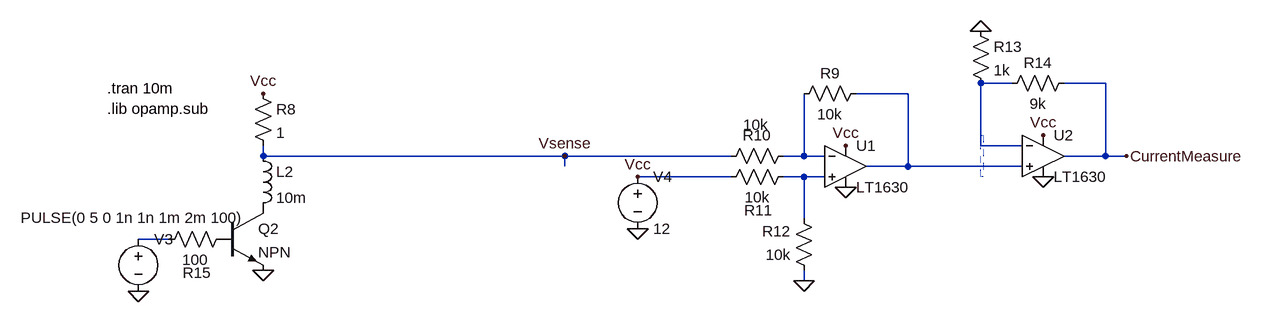
[diagram p0: schematic Circuit Simulation.asc]
Circuit Simulation.asc, the LTspice schematic file:
Version 4
SHEET 1 2996 680
WIRE 2640 -336 2592 -336
WIRE 2784 -336 2720 -336
WIRE 2480 -320 2400 -320
WIRE 2592 -240 2592 -336
WIRE 2656 -240 2592 -240
WIRE 1488 -224 1488 -240
WIRE 1952 -224 1488 -224
WIRE 2208 -224 1952 -224
WIRE 2320 -224 2320 -320
WIRE 2320 -224 2288 -224
WIRE 2352 -224 2320 -224
WIRE 2784 -224 2784 -336
WIRE 2784 -224 2720 -224
WIRE 2816 -224 2784 -224
WIRE 1952 -208 1952 -224
WIRE 2480 -208 2480 -320
WIRE 2480 -208 2416 -208
WIRE 2656 -208 2480 -208
WIRE 2208 -192 2064 -192
WIRE 2320 -192 2288 -192
WIRE 2352 -192 2320 -192
WIRE 2320 -128 2320 -192
WIRE 1344 -96 1296 -96
WIRE 2320 -32 2320 -48
FLAG 1488 -320 Vcc
FLAG 1488 -48 0
FLAG 1296 -16 0
FLAG 2320 -32 0
FLAG 2064 -112 0
FLAG 2384 -176 0
FLAG 2384 -240 Vcc
FLAG 2064 -192 Vcc
FLAG 1952 -224 Vsense
FLAG 2688 -192 0
FLAG 2592 -416 0
FLAG 2688 -256 Vcc
FLAG 2816 -224 CurrentMeasure
SYMBOL res 1472 -336 R0
SYMATTR InstName R8
SYMATTR Value 1
SYMBOL ind 1472 -240 R0
SYMATTR InstName L2
SYMATTR Value 10m
SYMATTR SpiceLine Rser=23
SYMBOL npn 1424 -144 R0
SYMATTR InstName Q2
SYMBOL voltage 1296 -112 R0
WINDOW 3 -181 -17 Left 2
SYMATTR Value PULSE(0 5 0 1n 1n 1m 2m 100)
SYMATTR InstName V3
SYMBOL res 2416 -336 R90
WINDOW 0 0 56 VBottom 2
WINDOW 3 32 56 VTop 2
SYMATTR InstName R9
SYMATTR Value 10k
SYMBOL res 2304 -240 R90
WINDOW 0 0 56 VBottom 2
WINDOW 3 -48 58 VTop 2
SYMATTR InstName R10
SYMATTR Value 10k
SYMBOL res 2304 -208 R90
WINDOW 0 83 54 VBottom 2
WINDOW 3 32 56 VTop 2
SYMATTR InstName R11
SYMATTR Value 10k
SYMBOL res 2336 -32 R180
WINDOW 0 36 76 Left 2
WINDOW 3 36 40 Left 2
SYMATTR InstName R12
SYMATTR Value 10k
SYMBOL voltage 2064 -208 R0
SYMATTR InstName V4
SYMATTR Value 12
SYMBOL res 2576 -432 R0
SYMATTR InstName R13
SYMATTR Value 1k
SYMBOL res 2736 -352 R90
WINDOW 0 0 56 VBottom 2
WINDOW 3 32 56 VTop 2
SYMATTR InstName R14
SYMATTR Value 9k
SYMBOL res 1440 -112 R90
WINDOW 0 83 54 VBottom 2
WINDOW 3 32 56 VTop 2
SYMATTR InstName R15
SYMATTR Value 100
SYMBOL Opamps/LT1630 2384 -272 R0
SYMATTR InstName U1
SYMBOL Opamps/LT1630 2688 -288 R0
SYMATTR InstName U2
TEXT 1248 -328 Left 2 !.tran 10m\n.lib opamp.sub
RECTANGLE Normal 2592 -256 2596 -192 2

The netlist it stands for:
* Circuit Simulation.asc
R8 Vcc Vsense 1
L2 Vsense P001 10m Rser=23
Q2 P001 P002 0 0 NPN
V3 N005 0 PULSE(0 5 0 1n 1n 1m 2m 100)
R9 N002 N003 10k
R10 N003 Vsense 10k
R11 N004 Vcc 10k
R12 0 N004 10k
V4 Vcc 0 12
R13 0 N001 1k
R14 CurrentMeasure N001 9k
R15 P002 N005 100
XU1 N004 N003 Vcc 0 N002 LT1630  ; pins In+ In- V+ V- OUT
XU2 N002 N001 Vcc 0 CurrentMeasure LT1630  ; pins In+ In- V+ V- OUT
.model NPN NPN
.model PNP PNP
.lib standard.bjt
.tran 10m
.lib opamp.sub
.backanno
.end